# Altium schematic sheet Gastroscopy-CutController_Button.SchDoc: Buttons
size 279 x 215 mm; Date: not used; ApprovedBy: not used; CheckedBy: not used; Author: not used; DrawnBy: not used; Organization: not used; Address4: not used; SheetNumber: 4; SheetTotal: 8; Time: not used; ImagePath: not used; Application_BuildNumber: not used
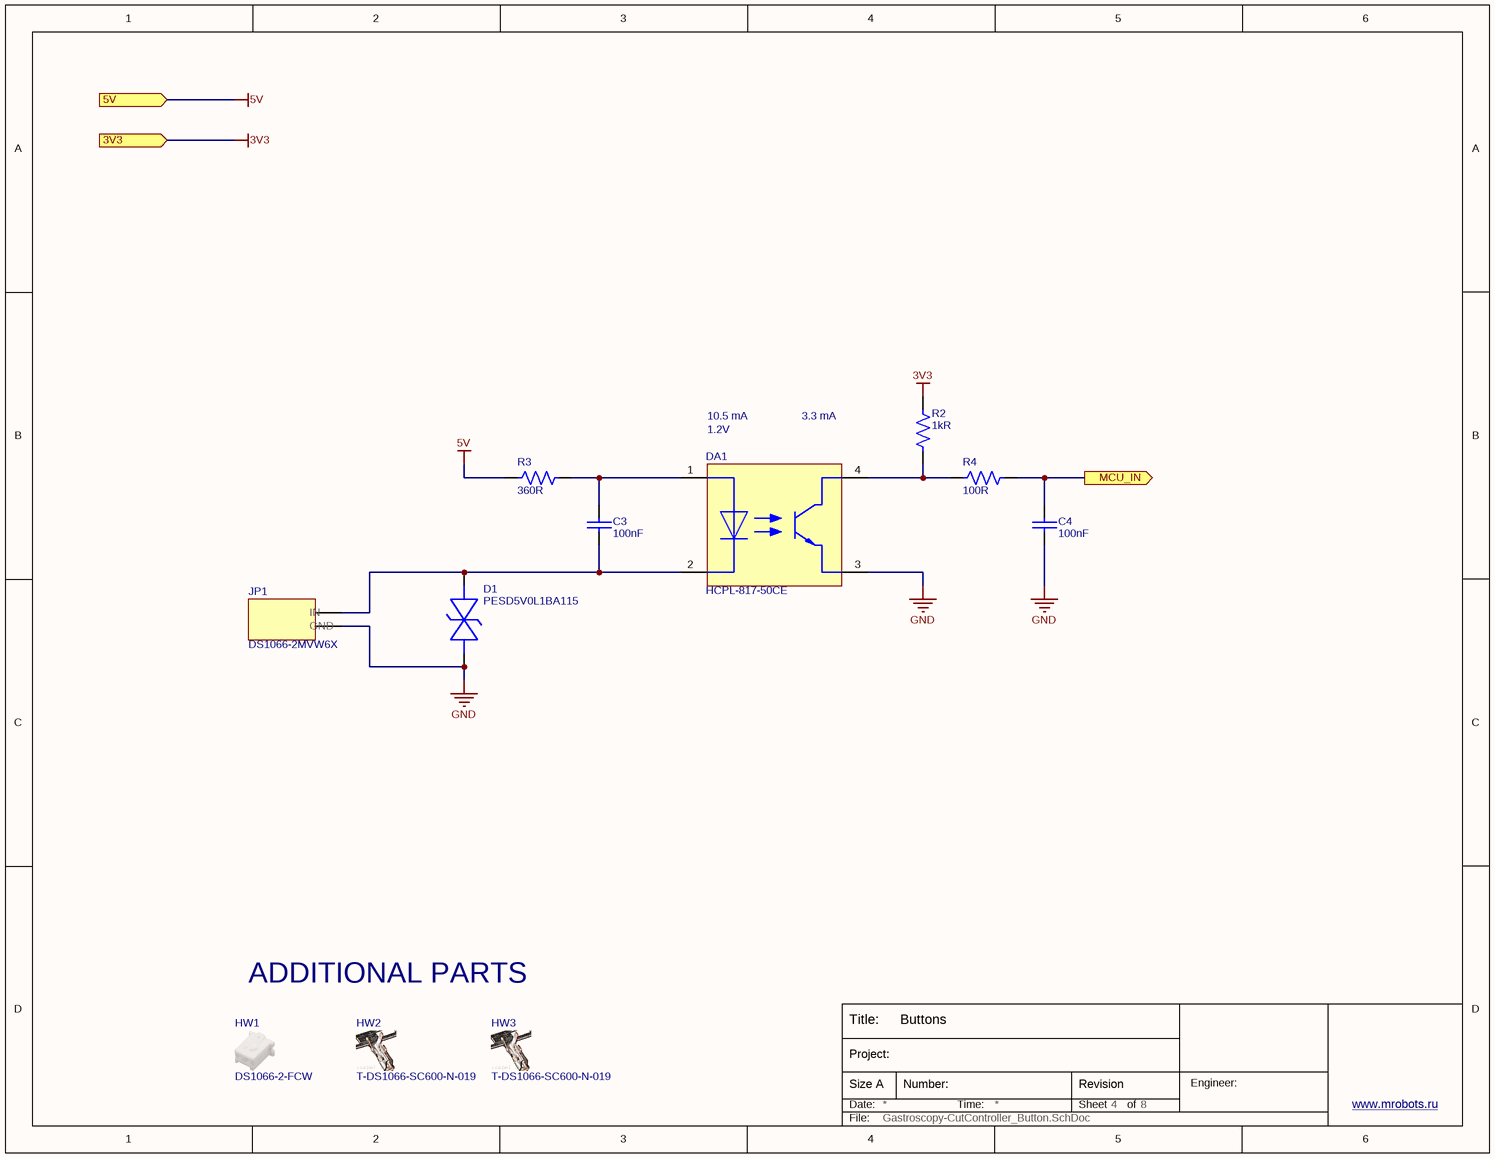
[diagram p0: Gastroscopy-CutController_Button.SchDoc]

## Parts
C3  100nF  [CAP_0603]
C4  100nF  [CAP_0603]
D1  PESD5V0L1BA115  [SOD-323]
DA1  HCPL-817-50CE  [HCPL-817-50CE]
HW1  DS1066-2-FCW  (mechanical)
HW2  T-DS1066-SC600-N-019  (mechanical)
HW3  T-DS1066-SC600-N-019  (mechanical)
JP1  DS1066-2MVW6X  [DS1066-2MVW6X]
R2  1kR  [RES_0603]
R3  360R  [RES_0603]
R4  100R  [RES_0603]

## Ports
3V3 (in), 5V (in), MCU_IN (out)

## Nets
3V3: R2.1 ; port 3V3
5V: R3.1 ; port 5V
GND: C4.2 D1.2 DA1.3(EMITTER) JP1.2
MCU_IN: C4.1 R4.1 ; port MCU_IN
NetC3_1: C3.1 DA1.1(ANODE) R3.2
NetC3_2: C3.2 D1.1 DA1.2(CATHODE) JP1.1
NetDA1_4: DA1.4(COLLECTOR) R2.2 R4.2

## Notes on the sheet
- (near DA1) 1.2V
- 10.5 mA
- 3.3 mA
- ADDITIONAL PARTS
- Title:
- Date:
- Size A
- Project:
- Number:
- Time:
- Sheet
- Revision
- of
- Engineer:
- www.mrobots.ru <http://mrobots.ru/>
- File:

## Library data of the parts
C3 C4 = CL10B104KB8NNNL: CAP CER 0.1UF 50V X7R 0603; Manufacturer 1: Samsung; Tolerance: 10%; Supplier 1: Digi-Key; Manufacturer Part Number 1: CL10B104KB8NNNL; RoHS: Yes; Category: Ceramic Capacitors; Stock 1: 2348404; Pricing 1: 15000=0,00532, 30000=0,00506 (USD); Mount: Surface Mount; Case/Package: 0603; Min Operating Temperature: -55°C; Max Operating Temperature: 125°C; Capacitance: 100nF; Packaging: Tape and Reel; Package Quantity: 15000; Voltage Rating: 50V; Dielectric: X7R; Voltage Rating (DC): 50V; Series: CL; Construction: Flat; Length: 1.6mm; Width: 0.031inch; Height: 0.8mm; Thickness: 0.035inch; Depth: 0.8mm; Radiation Hardening: No; RoHS Compliant: Yes; ComponentLink1URL: https://datasheet.ciiva.com/26838/getdatasheetpartid-357523-26838415.pdf?src-supplier=Verical; ComponentLink1Description: https://datasheet.ciiva.com/26838/getdatasheetpartid-357523-26838415.pdf?src-supplier=Verical; ComponentLink2URL: https://datasheet.ciiva.com/25741/cl10b104kb8nnnl-25741341.pdf?src-supplier=Digi-Key; ComponentLink2Description: https://datasheet.ciiva.com/25741/cl10b104kb8nnnl-25741341.pdf?src-supplier=Digi-Key; Supplier Part Number 1: 1276-CL10B104KB8NNNLTR-ND
D1 = PESD5V0L1BA,115: TVS DIODE 5VWM 33VC SOD323; Manufacturer 1: NXP Semiconductors; Description: Diode Esd Prot; Direction: Bidirectional; Capacitance: 75pF; Number of Channels: 1; Reverse Breakdown Voltage: 7V; Operating Supply Voltage: 5V; Max Surge Current: 15A; Clamping Voltage: 33V; Peak Pulse Power: 500W; Power Line Protection: No; Leakage Current: 1uA; Max Breakdown Voltage: 8.2V; Test Current: 5mA; Element Configuration: Single; Diode Type: ZENER; Supplier 1: Newark; Manufacturer Part Number 1: PESD5V0L1BA115; RoHS: Yes; Category: Uncategorized; Mount: Surface Mount; Number of Pins: 2; Weight: 0.01lb; Contact Plating: Tin; Min Operating Temperature: -65°C; Max Operating Temperature: 150°C; Package Quantity: 1; Packaging: Cut Tape; Number of Elements: 1; Number of Bidirectional Channels: 1; Reverse Standoff Voltage: 5V; Min Breakdown Voltage: 7V; Polarity: Bidirectional; Breakdown Voltage: 7V; Termination: SMD/SMT; Working Voltage: 5V; Peak Pulse Current: 15A; Max Power Dissipation: 500W; Resistor Type: Zener; Series: -; Clamping Voltage-Max: 33V; Length: 1.8mm; Width: 0.25inch; Height: 0.25inch; Depth: 1.35mm; Radiation Hardening: No; Reach SVHC Compliant: Yes; Lead Free: Lead Free; ComponentLink1URL: https://datasheet.ciiva.com/334/pesdxl1ba-ser-334048.pdf?src-supplier=Digi-Key; ComponentLink1Description: https://datasheet.ciiva.com/334/pesdxl1ba-ser-334048.pdf?src-supplier=Digi-Key; ComponentLink2URL: https://datasheet.ciiva.com/1219/682594-1219455.pdf?src-supplier=Newark; ComponentLink2Description: https://datasheet.ciiva.com/1219/682594-1219455.pdf?src-supplier=Newark; ComponentLink3URL: https://datasheet.ciiva.com/334/pesdxl1ba-ser-334050.pdf?src-supplier=Digi-Key; ComponentLink3Description: https://datasheet.ciiva.com/334/pesdxl1ba-ser-334050.pdf?src-supplier=Digi-Key; ComponentLink4URL: https://datasheet.ciiva.com/334/pesdxl1ba-ser-334051.pdf?src-supplier=Digi-Key; ComponentLink4Description: https://datasheet.ciiva.com/334/pesdxl1ba-ser-334051.pdf?src-supplier=Digi-Key; ComponentLink5URL: https://datasheet.ciiva.com/6574/pesdxl1ba-ser-6574197.pdf?src-supplier=Digi-Key; ComponentLink5Description: https://datasheet.ciiva.com/6574/pesdxl1ba-ser-6574197.pdf?src-supplier=Digi-Key; Supplier Part Number 1: 70R7330
DA1 = HCPL-817-50CE: OPTOISOLATOR 5KV TRANSISTOR 4SMD; Manufacturer 1: Broadcom Avago; Reverse Breakdown Voltage: 6V; Forward Voltage: 1.2V; Forward Current: 50mA; Rise Time: 18000ns; Max Power Dissipation: 200mW; Number of Channels: 1; Collector Emitter Voltage (VCEO): 35V; Collector Emitter Saturation Voltage: 200mV; Max Output Voltage: 70V; Current Transfer Ratio: 400%; Input Current: 20mA; Input Type: DC; Approvals: UL; Supplier 1: Mouser; RoHS: Yes; Category: Optocouplers; Stock 1: 53747; Pricing 1: 1=0,55000, 10=0,35900, 50=0,35900, 100=0,23700, 1000=0,18200, 10000=0,15000 (USD); Mount: Surface Mount; Case/Package: SMD/SMT; Number of Pins: 4; Min Operating Temperature: -30°C; Max Operating Temperature: 100°C; Package Quantity: 1000; Packaging: Tape and Reel; Max Collector Current: 50mA; Output Current per Channel: 50mA; Number of Elements: 1; Power Dissipation: 200mW; Fall Time: 18000ns; Max Input Current: 50mA; Collector Emitter Breakdown Voltage: 70V; Isolation Voltage: 5kV; Number of Circuits: 1; Output Voltage: 70V; Series: -; Collector-emitter Voltage-Max: 200mV; Lead Free: Lead Free; RoHS Compliant: Yes; ComponentLink1URL: https://datasheet.ciiva.com/32424/hcpl-817-00ae-eng-tds-32424469.pdf?src-supplier=Distrelec; ComponentLink1Description: https://datasheet.ciiva.com/32424/hcpl-817-00ae-eng-tds-32424469.pdf?src-supplier=Distrelec; ComponentLink2URL: https://datasheet.ciiva.com/4702/v02-0265en-106799-4702156.pdf?src-supplier=Mouser; ComponentLink2Description: https://datasheet.ciiva.com/4702/v02-0265en-106799-4702156.pdf?src-supplier=Mouser; Supplier Part Number 1: 630-HCPL-817-50CE; Manufacturer Part Number 1: HCPL-817-50CE
HW1 = DS1066-2-FCW: CONN SOCKET 2POS 2MM; Manufacturer 1: Connfly electronic (Zhenqin); Manufacturer Part Number 1: DS1066-2-FCW
HW2 HW3 = T-DS1066-SC600-N-019: СONNECTOR DS1066; Manufacturer 1: Connfly electronic (Zhenqin); Manufacturer Part Number 1: T-DS1066-SC600-N-019
JP1 = DS1066-2MVW6X: CONN HEADER 2POS 2MM; Manufacturer 1: Connfly electronic (Zhenqin); Contact_1: IN; Contact_2: GND; Manufacturer Part Number 1: DS1066-2MVW6X
R2 = RC0603FR-071KL: RES 1K OHM 1% 1/10W 0603; Manufacturer 1: Yageo; Temperature Coefficient: 100ppm/°C; Power Rating: 100mW; Voltage Rating: 50V; Supplier 1: Arrow Electronics; Manufacturer Part Number 1: RC0603FR-071KL; RoHS: Yes; Category: Chip SMD Resistors; Stock 1: 480000; Pricing 1: 5000=0,00240, 10000=0,00230, 25000=0,00220, 125000=0,00190 (USD); Case/Package: 0603; Contact Plating: Tin,Matte; Case Code (Imperial): 0603; Case Code (Metric): 1608; Size Code: 0603; Min Operating Temperature: -55°C; Max Operating Temperature: 155°C; Tolerance: 1%; Resistance: 1kR; Packaging: Tape and Reel; Resistor Type: Thick Film; Termination: SMD/SMT; Features: Moisture Resistant; Series: RC; Max Power Dissipation: 100mW; Number of Terminations: 2; Technology: THICK FILM; Resistance Tolerance: 1%; Construction: Rectangular; Length: 1.6mm; Height: 0.45mm; Depth: 0.8mm; Radiation Hardening: No; REACH SVHC: No SVHC; Lead Free: Lead Free; Military Standard: Not; RoHS Compliant: Yes; Supplier Part Number 1: RC0603FR-071KL
R3 = RC0603FR-07360RL: RES 360 OHM 1% 1/10W 0603; Manufacturer 1: Yageo; Power Rating: 100mW; Voltage Rating: 50V; Temperature Coefficient: 100ppm/°C; Supplier 1: Arrow Electronics; RoHS: Yes; Category: Chip SMD Resistors; Stock 1: 7884; Pricing 1: 1=0,05320, 10=0,01120, 100=0,00760, 250=0,00660, 1000=0,00380, 3000=0,00370, 6000=0,00230 (USD); Case/Package: 0603; Case Code (Metric): 1608; Case Code (Imperial): 0603; Size Code: 0603; Min Operating Temperature: -55°C; Max Operating Temperature: 155°C; Packaging: Tape and Reel; Resistance: 360R; Tolerance: 1%; Package Quantity: 1; Resistor Type: Thick Film; Number of Terminations: 2; Termination: SMD/SMT; Max Power Dissipation: 100mW; Voltage Rating (DC): 50V; Features: Moisture Resistant; Series: RC; Construction: Rectangular; Length: 1.6mm; Width: 0.031inch; Height: 0.022inch; Depth: 0.8mm; Military Standard: Not; Lead Free: Lead Free; RoHS Compliant: Yes; ComponentLink1URL: https://datasheet.ciiva.com/2454/pyu-r-int-thick-7-2454271.pdf?src-supplier=Digi-Key; ComponentLink1Description: https://datasheet.ciiva.com/2454/pyu-r-int-thick-7-2454271.pdf?src-supplier=Digi-Key; ComponentLink2URL: https://datasheet.ciiva.com/2454/pyu-r-int-thick-7-2454272.pdf?src-supplier=Digi-Key; ComponentLink2Description: https://datasheet.ciiva.com/2454/pyu-r-int-thick-7-2454272.pdf?src-supplier=Digi-Key; ComponentLink3URL: https://datasheet.ciiva.com/2454/pyu-r-int-thick-7-2454270.pdf?src-supplier=Digi-Key; ComponentLink3Description: https://datasheet.ciiva.com/2454/pyu-r-int-thick-7-2454270.pdf?src-supplier=Digi-Key; ComponentLink4URL: https://datasheet.ciiva.com/12558/rc0603-272842-12558645.pdf?src-supplier=Mouser; ComponentLink4Description: https://datasheet.ciiva.com/12558/rc0603-272842-12558645.pdf?src-supplier=Mouser; Supplier Part Number 1: RC0603FR-07360RL; Manufacturer Part Number 1: RC0603FR-07360RL
R4 = RC0603FR-07100RL: RES 100 OHM 1% 1/10W 0603; Manufacturer 1: Yageo; Voltage Rating (DC): 50V; Temperature Coefficient: 100ppm/°C; Power Rating: 100mW; Supplier 1: Arrow Electronics; RoHS: Yes; Category: Chip SMD Resistors; Stock 1: 17580000; Pricing 1: 5000=0,00180 (USD); Case/Package: 0603; Number of Pins: 2; Case Code (Imperial): 0603; Case Code (Metric): 1608; Size Code: 0603; Min Operating Temperature: -55°C; Max Operating Temperature: 155°C; Resistance: 100R; Tolerance: 1%; Packaging: Tape and Reel; Resistor Type: Thick Film; Voltage Rating: 50V; Termination: SMD/SMT; Features: Moisture Resistant; Series: RC; Max Power Dissipation: 100mW; Number of Terminations: 2; Construction: Rectangular; Resistance Tolerance: 1%; Technology: THICK FILM; Length: 1.6mm; Width: 0.8mm; Height: 0.45mm; Depth: 0.8mm; REACH SVHC: Unknown; Lead Free: Lead Free; Military Standard: Not; RoHS Compliant: Yes; Supplier Part Number 1: RC0603FR-07100RL; Manufacturer Part Number 1: RC0603FR-07100RL